# EAGLE design SOL_R2 (EAGLE 7.7.0)

## Sheet 1 of 2
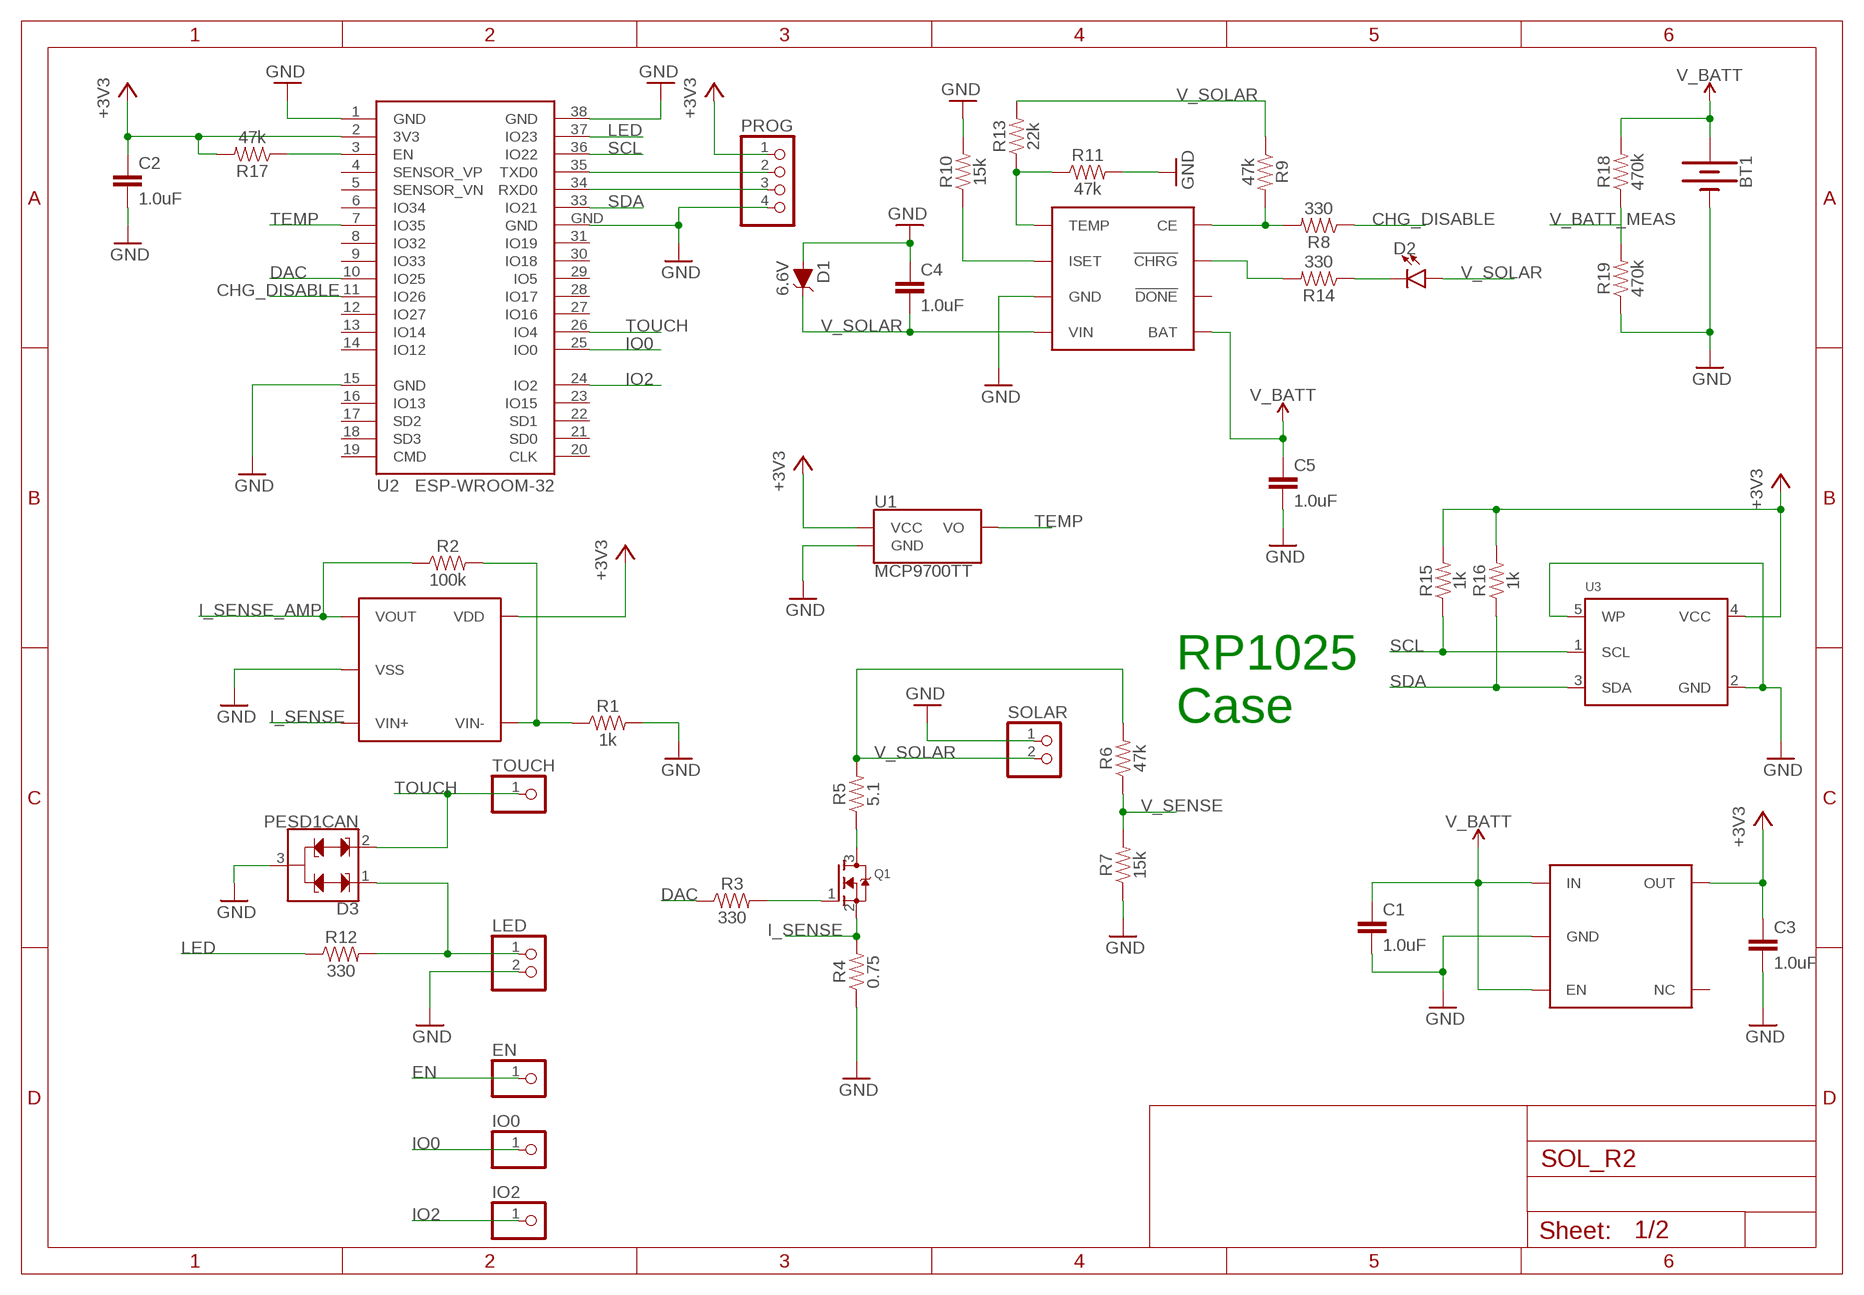
[diagram p0: schematic, sheet 1]

### Parts
BT1  BATTERY-AA  [BATTERY-AA]
C1  1.0uF  1.0UF-0805-25V-10%  [0805]
C2  1.0uF  1.0UF-0805-25V-10%  [0805]
C3  1.0uF  1.0UF-0805-25V-10%  [0805]
C4  1.0uF  1.0UF-0805-25V-10%  [0805]
C5  1.0uF  1.0UF-0805-25V-10%  [0805]
D1  6.6V  DIODE-ZENER-MMSZ5232BS  [SOD-323]
D2  LED0603  [LED-0603]
D3  PESD1CAN  [SOT23-3]
EN  PINHD-1X1  [1X01]
IO0  PINHD-1X1  [1X01]
IO2  PINHD-1X1  [1X01]
LED  PINHD-1X2  [1X02]
PROG  PINHD-1X4  [1X04]
Q1  MOSFET-NREFLOW  [SOT23-R]
R1  1k  2.2KOHM-0603-1/10W-1%  [0603]
R2  100k  2.2KOHM-0603-1/10W-1%  [0603]
R3  330  2.2KOHM-0603-1/10W-1%  [0603]
R4  0.75  0.3OHM-0805-1/8W-1%  [0805]
R5  5.1  33OHM-0603-1/10W-1%  [0603]
R6  47k  47KOHM-0603-1/10W-1%  [0603]
R7  15k  15KOHM-0603-1/10W-1%  [0603]
R8  330  2.2KOHM-0603-1/10W-1%  [0603]
R9  47k  47KOHM-0603-1/10W-1%  [0603]
R10  15k  15KOHM-0603-1/10W-1%  [0603]
R11  47k  47KOHM-0603-1/10W-1%  [0603]
R12  330  2.2KOHM-0603-1/10W-1%  [0603]
R13  22k  47KOHM-0603-1/10W-1%  [0603]
R14  330  2.2KOHM-0603-1/10W-1%  [0603]
R15  1k  2.2KOHM-0603-1/10W-1%  [0603]
R16  1k  2.2KOHM-0603-1/10W-1%  [0603]
R17  47k  47KOHM-0603-1/10W-1%  [0603]
R18  470k  2.2KOHM-0603-1/10W-1%  [0603]
R19  470k  2.2KOHM-0603-1/10W-1%  [0603]
SOLAR  PINHD-1X2  [1X02]
TOUCH  PINHD-1X1  [1X01]
U1  MCP9700TT  [SOT23-3]
U2  ESP-WROOM-32  [ESP-WROOM-32]
U3  EEPROM_I2C_MCP24AA32  [SOT23-5]
U5  MCP6001  [SOT23-5L]
U6  TLV755  [SOT23-DBV]
U7  DIO5158XM8  [MSOP8]

### Nets
+3V3: C2.1 C3.1 PROG.1 R15.2 R16.2 R17.2 U1.1(VCC) U2.2(3V3) U3.4(VCC) U5.5(VDD) U6.5(OUT) ; also sheet 2
CHG_DISABLE: R8.1 U2.11(IO26)
DAC: R3.1 U2.10(IO25)
EN: EN.1 R17.1 U2.3(EN)
GND: BT1.GND@1(-) C1.2 C2.2 C3.2 C4.1 C5.2 D1.A D3.3 LED.2 PROG.4 R1.2 R4.1 R7.1 R10.2 R11.2 R19.1 SOLAR.1 U1.3(GND) U2.1(GND) U2.15(GND) U2.38(GND) U2.GND U3.2(GND) U3.5(WP) U5.2(VSS) U6.2(GND) U7.3(GND) ; also sheet 2
I_SENSE: Q1.2(S) R4.2 U5.3(VIN+)
I_SENSE_AMP: R2.1 U5.1(VOUT) ; also sheet 2
IO0: IO0.1 U2.25(IO0)
IO2: IO2.1 U2.24(IO2)
LED: R12.1 U2.37(IO23)
N$2: R10.1 U7.2(ISET)
N$3: D3.1 LED.1 R12.2
N$4: R11.1 R13.1 U7.1(TEMP)
N$5: Q1.1(G) R3.2
N$6: R1.1 R2.2 U5.4(VIN-)
N$7: Q1.3(D) R5.1
N$8: R8.2 R9.2 U7.8(CE)
N$9: R14.2 U7.7(!CHRG!)
N$11: D2.C R14.1
RXD: PROG.3 U2.34(RXD0)
SCL: R15.1 U2.36(IO22) U3.1(SCL) ; also sheet 2
SDA: R16.1 U2.33(IO21) U3.3(SDA) ; also sheet 2
TEMP: U1.2(VO) U2.7(IO35)
TOUCH: D3.2 TOUCH.1 U2.26(IO4)
TXD: PROG.2 U2.35(TXD0)
V_BATT: BT1.PWR@1(+) C1.1 C5.1 R18.2 U6.1(IN) U6.3(EN) U7.5(BAT)
V_BATT_MEAS: R18.1 R19.2 ; also sheet 2
V_SENSE: R6.1 R7.2 ; also sheet 2
V_SOLAR: C4.2 D1.C D2.A R5.2 R6.2 R9.1 R13.2 SOLAR.2 U7.4(VIN)
Unconnected: U2.4(SENSOR_VP) U2.5(SENSOR_VN) U2.6(IO34) U2.8(IO32) U2.9(IO33) U2.12(IO27) U2.13(IO14) U2.14(IO12) U2.16(IO13) U2.17(SD2) U2.18(SD3) U2.19(CMD) U2.20(CLK) U2.21(SD0) U2.22(SD1) U2.23(IO15) U2.27(IO16) U2.28(IO17) U2.29(IO5) U2.30(IO18) U2.31(IO19) U6.4(NC) U7.6(!DONE!)

### Notes on the sheet
- RP1025
  Case

## Sheet 2 of 2
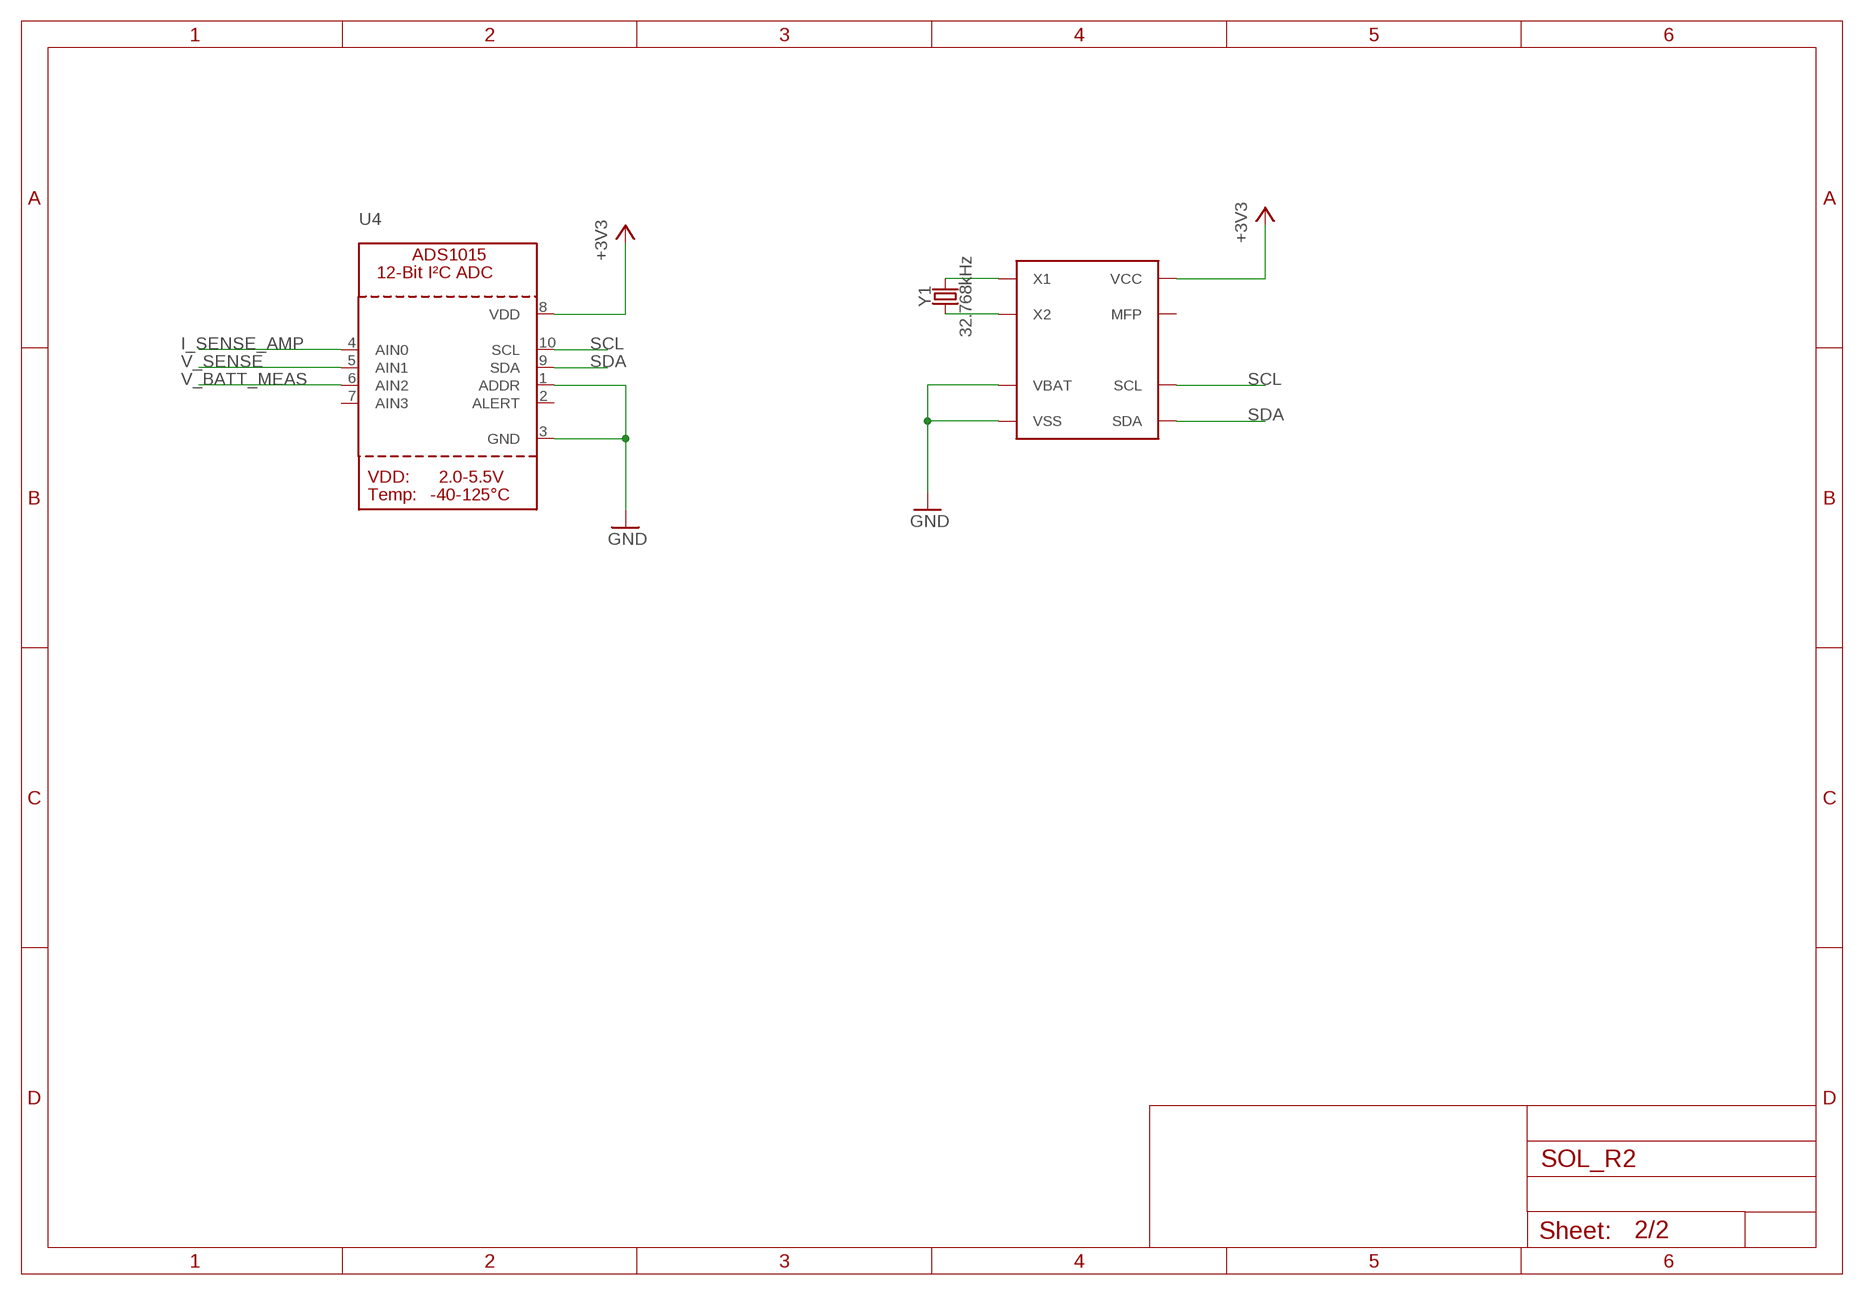
[diagram p1: schematic, sheet 2]

### Parts
U4  ADC_ADS1015  [MSOP10]
U8  MCP7940  [MSOP8]
Y1  32.768kHz  CRYSTAL-32.768KHZSMD-3.2X1.5  [CRYSTAL-SMD-3.2X1.5MM]

### Nets
+3V3: U4.8(VDD) U8.8(VCC) ; also sheet 1
GND: U4.1(ADDR) U4.3(GND) U8.3(VBAT) U8.4(VSS) ; also sheet 1
I_SENSE_AMP: U4.4(AIN0) ; also sheet 1
N$1: U8.1(X1) Y1.P$2
N$10: U8.2(X2) Y1.P$1
SCL: U4.10(SCL) U8.6(SCL) ; also sheet 1
SDA: U4.9(SDA) U8.5(SDA) ; also sheet 1
V_BATT_MEAS: U4.6(AIN2) ; also sheet 1
V_SENSE: U4.5(AIN1) ; also sheet 1
Unconnected: U4.2(ALERT) U4.7(AIN3) U8.7(MFP)

## Library data of the parts
BT1 = SparkFun-Batteries:BATTERY: Battery - Single Cell A variety of battery chemistries, sizes, and footprints. Device List: 20MM_PTH - Coin Cell Battery Holder - 20mm (PTH) <https://www.sparkfun.com/products/783> 12MM_SMD - Coin Cell Battery Holder - 12mm (SMD) <https://www.sparkfun.com/products/10592> 12MM_PTH - Coin Cell Battery Holder - 12mm (PTH) <https://www.sparkfun.com/products/7948> 20MM_SMD - 20mm Coin Cell Battery Holder (SMD) (2 legs) Used on the Big Time Watch Kit <https://www.sparkfun.com/products/11734> 20MM_SMD_4LEGS - Coin Cell Battery Holder - 20mm (SMD) <https://www.sparkfun.com/products/11892> 20MM_SMD_4LEGS_OVERPASTE - Coin Cell Battery Holder - 20mm (SMD) <https://www.sparkfun.com/products/11892> (Over-paste on the legs) 24.5MM_PTH - Coin Cell Battery Holder - 24.5mm (PTH) <https://www.sparkfun.com/products/8863> 9V - 9V Battery Holder - PC Mount Used on the SparkFun SparkPunk Sound Kit <https://www.sparkfun.com/products/11177> and SparkFun SparkPunk Sequencer Kit <https://www.sparkfun.com/products/12707> 18650 - Battery Holder - 18650 (PTH) <https://www.sparkfun.com/products/13113> AA - Battery Holder - 1xAA (PTH) <https://www.sparkfun.com/products/7949> AAA - Battery Holder - 1xAAA (PTH) <https://www.sparkfun.com/products/12718> AA_KIT - Battery Holder - 1xAA (PTH) <https://www.sparkfun.com/products/7949> Special kit package - pads only have exposed copper on one side of the board. AAA_KIT - Battery Holder - 1xAAA (PTH) <https://www.sparkfun.com/products/12718> Special kit package - pads only have exposed copper on one side of the board.; PROD_ID: BATT-08316; SF_SKU: PRT-07949
C1-C5 = SparkFun-Capacitors:1.0UF: 1µF ceramic capacitors A capacitor is a passive two-terminal electrical component used to store electrical energy temporarily in an electric field.; PROD_ID: CAP-08064
D1 = SparkFun-DiscreteSemi:DIODE-ZENER: Zener Diode A Zener diode allows current to flow from its anode to its cathode like a normal semiconductor diode, but it also permits current to flow in the reverse direction when its "Zener voltage" is reached. - WIkipedia; PROD_ID: DIO-12442; VALUE: 5.6V
D2 = SparkFun-LED:LED: LED (Generic) Standard schematic elements and footprints for 5mm, 3mm, 1206, and 0603 sized LEDs. Generic LEDs with no color specified.
D3 = SparkFun-DiscreteSemi:PESD1CAN: CAN bus ESD protection diode PESD1CAN is used to protect two CAN bus lines from ESD. Link to datasheet <http://www.nxp.com/documents/data_sheet/PESD1CAN-U.pdf> SparkFun Products: SparkFun CAN-BUS Shield <https://www.sparkfun.com/products/13262>; PROD_ID: DIO-12501
EN IO0 IO2 TOUCH = pinhead:PINHD-1X1: PIN HEADER
LED SOLAR = pinhead:PINHD-1X2: PIN HEADER
PROG = pinhead:PINHD-1X4: PIN HEADER
Q1 = microbuilder:MOSFET-N: N-Channel Mosfet LEGEND VDS: Voltage Drain-Source ID: Drain Current RDS(ON): Drain-Source On-State Resistance VGS(TH): Gate-Source Threshold Voltage CISS: Drain-Source Input Capacitance SOT-23 Name VDS ID RDS(ON) VGS(TH) CISS Order Number 2N7002E 60V 260mA 2.5 Ohm 2.5V @ 250uA 26.7pF @ 25V 2N7002ET1GOSTR-ND BSH103 30V 850mA 400 mOhm 400mV @ 1mA 83pF @ 24V BSH103,235-ND BSS138 60V 320mA 1.6 Ohm 1.5V @ 250uA 50pF @ 10V Mouser: 771-BSS138PW115 DMN2075U-7 20V 4.2A 38 mOhm 1V @ 250 uA 594.3pF @ 10V DMN2075U-7DICT-ND * BSS138 good choice for I2C level-shifting
R1-R3 R8 R12 R14-R16 R18 R19 = SparkFun-Resistors:2.2KOHM: 2.2kΩ resistor A resistor is a passive two-terminal electrical component that implements electrical resistance as a circuit element. Resistors act to reduce current flow, and, at the same time, act to lower voltage levels within circuits. - Wikipedia; PROD_ID: RES-08272; VALUE: 2.2k
R4 = SparkFun-Resistors:0.3OHM: 0.3Ω resistor A resistor is a passive two-terminal electrical component that implements electrical resistance as a circuit element. Resistors act to reduce current flow, and, at the same time, act to lower voltage levels within circuits. - Wikipedia; PROD_ID: RES-11622; VALUE: 0.3
R5 = SparkFun-Resistors:33OHM: 33Ω resistor A resistor is a passive two-terminal electrical component that implements electrical resistance as a circuit element. Resistors act to reduce current flow, and, at the same time, act to lower voltage levels within circuits. - Wikipedia; PROD_ID: RES-08270; VALUE: 33
R6 R9 R11 R17 = SparkFun-Resistors:47KOHM: 47kΩ resistor A resistor is a passive two-terminal electrical component that implements electrical resistance as a circuit element. Resistors act to reduce current flow, and, at the same time, act to lower voltage levels within circuits. - Wikipedia; PROD_ID: RES-07871
R7 R10 = SparkFun-Resistors:15KOHM: 15kΩ resistor A resistor is a passive two-terminal electrical component that implements electrical resistance as a circuit element. Resistors act to reduce current flow, and, at the same time, act to lower voltage levels within circuits. - Wikipedia; PROD_ID: RES-07854
R13 = SparkFun-Resistors:47KOHM: 47kΩ resistor A resistor is a passive two-terminal electrical component that implements electrical resistance as a circuit element. Resistors act to reduce current flow, and, at the same time, act to lower voltage levels within circuits. - Wikipedia; PROD_ID: RES-07871; VALUE: 47k
U1 = SparkFun-Sensors:MCP9700: Microchip MCP9700 Analog-Output Temperature Sensor The MCP9700 can accurately measure temperature from -40C to +150C. The output of the MCP9700 is calibrated to a slope of 10mV/°C and has a DC offset of 500mV. The offset allows reading negative temperatures without the need for a negative supply. Datasheet <http://ww1.microchip.com/downloads/en/DeviceDoc/20001942F.pdf> SparkFun Products LilyPad Temperature Sensor <https://www.sparkfun.com/products/8777> (DEV-08777) SparkFun Digital Sandbox <https://www.sparkfun.com/products/12651> (DEV-12651); PROD_ID: IC-08917
U2 = esp32:ESP-WROOM-32: Espressif Systems ESP-WROOM-32
U3 = microbuilder:EEPROM_I2C_MCP24AA32: Microchip 32K (4K x 8) 1.8V I2C EEPROM SOT23-5 [Digikey: 24AA32AFT-I/OTCT-ND]
U4 = microbuilder:ADC_ADS1015: ADS1015 - 12-bit 4-Channel I2C ADC with Internal PGA VDD: 2.0-5.5V Sampling Rate: 3.3ksps Gain Settings: 2/3, 1, 2, 4, 8, 16 I2C Address: ADDR low = 1001000x, ADDR high = 1001001x Internal Comparator The ADS1015 includes an internal comparator that can be set to output a high-level on ALERT when the conversion results exceeeds a pre-defined upper level, and will deassert itself when the level falls below a pre-defined lower threshold level. It can also be set to windowed mode where the ALERT pin will be asserted if the data exceeds the upper threshold or falls below the lower threshold.
U5 = microchip:MCP6001
U6 = texas:TLV755
U7 = DIOO:DIO5158XM8
U8 = microchip:MCP7940: RTC Real Time Clock
Y1 = SparkFun-Clocks:CRYSTAL-32.768KHZ: 32.768kHz Crystal Frequency: 32.768kHz Frequency Stability: ±20ppm Load Capacitance: 12.5pF (PTH-2X6 & SMD-3.2X1.5), 6pF (SMD-2X6) SparkFun Products: SparkFun BigTime Watch Kit <https://www.sparkfun.com/products/11734> SparkFun nRF52832 Breakout <https://www.sparkfun.com/products/13990> SparkFun Real Time Clock Module <https://www.sparkfun.com/products/12708>; PROD_ID: XTAL-13062

## Board
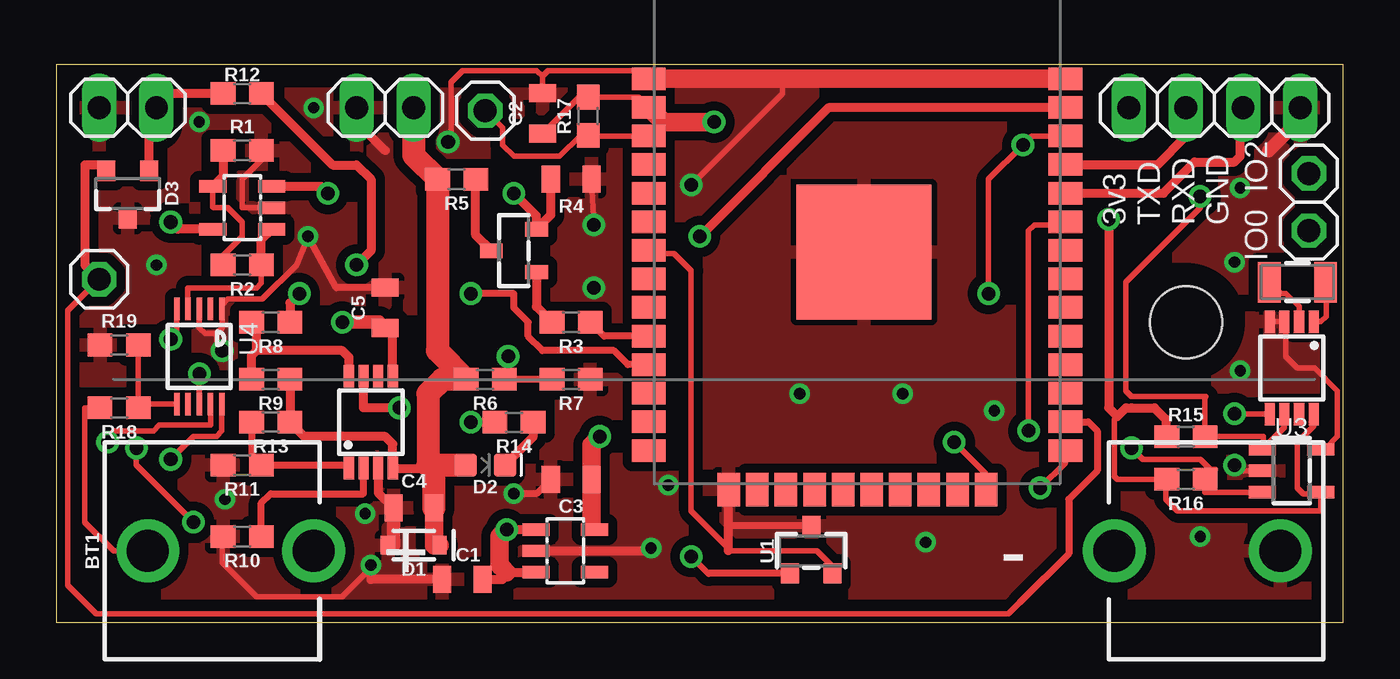
[diagram p2: board, top side]
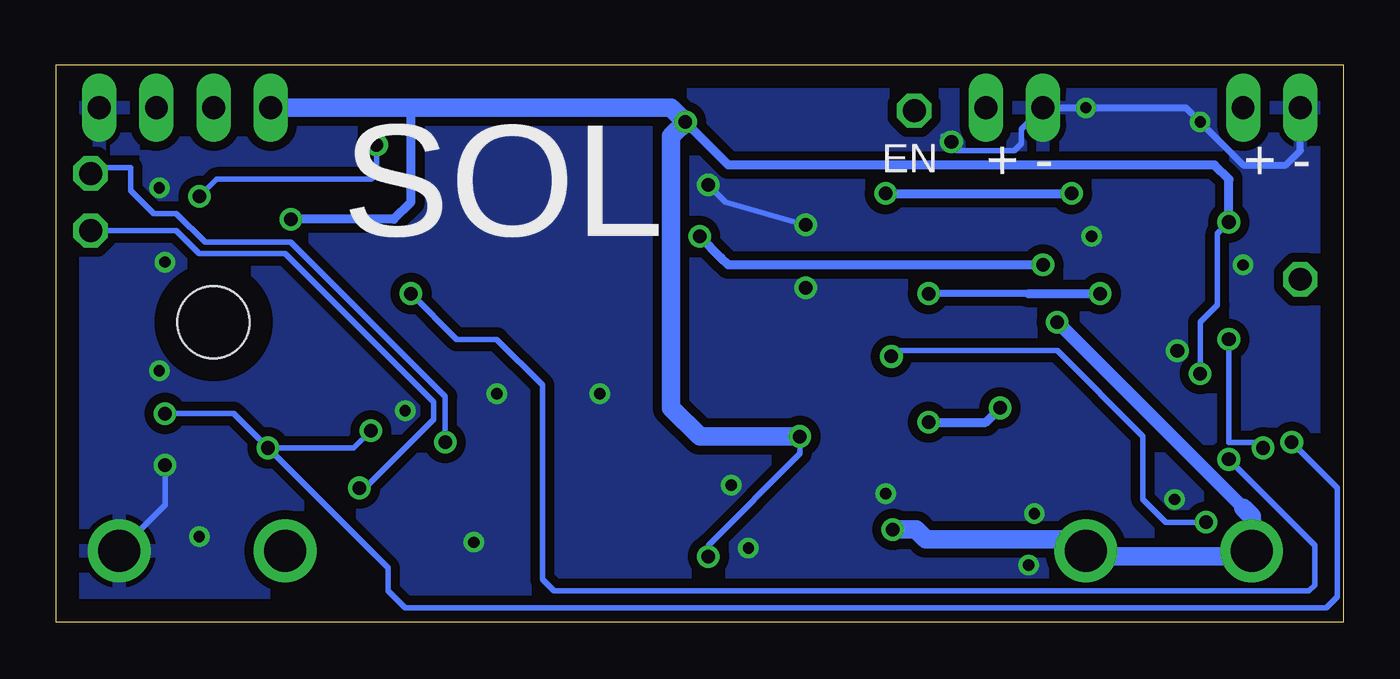
[diagram p3: board, bottom side, seen from below]

Size 57.15 x 24.77 mm. Coordinates in mm from the lower left corner, seen from the top.
Outline: 0,0 57.15,0 57.15,24.77 0,24.77 0,0
Copper layers (1*16): Top 0.035mm / dielectric 1.5mm / Bottom 0.035mm
Design rules "default": minimum track width 10mil, minimum drill 24mil, track to track 8mil, track to pad 8mil, pad to pad 8mil, via to via 8mil, smd to smd 8mil, copper to edge 40mil, drill to drill 8mil, minimum pad ring 10mil, minimum via ring 8mil, stop-mask expansion 4mil, vias tented up to drill 0mil, thermal gap 10mil
Holes 3.2 mm at 50.16,13.33

### Footprints (pad centres in the part's own frame; a part is rotated, then mirrored left to right if it is on the bottom)
BATTERY-AA = drill 1.854: GND@1 25.146,0; GND@2 17.78,0; PWR@1 -25.146,0; PWR@2 -17.78,0
0805 = smd 0.8 x 1.2: 1 -0.9,0; 2 0.9,0
SOD-323 = smd 0.63 x 0.83: A 1.15,0; C -1.15,0
LED-0603 = smd 1 x 1: A -0.877,0; C 0.877,0
SOT23-3 = smd 0.8 x 0.9: 1 -0.95,-1; 2 0.95,-1; 3 0,1.1
1X01 = drill 1.016 octagon: 1 0,0
1X02 = drill 1.016 long: 1 -1.27,0; 2 1.27,0
1X04 = drill 1.016 long: 1 -3.81,0; 2 -1.27,0; 3 1.27,0; 4 3.81,0
SOT23-R = smd 0.635 x 1.016: 1 -0.95,-1; 2 0.95,-1; 3 0,1
0603 = smd 1.1 x 1: 1 -0.85,0; 2 0.85,0
ESP-WROOM-32 = smd 1.5 x 1: 1 -9.25,7; 2 -9.25,5.73; 3 -9.25,4.46; 4 -9.25,3.19; 5 -9.25,1.92; 6 -9.25,0.65; 7 -9.25,-0.62; 8 -9.25,-1.89; 9 -9.25,-3.16; 10 -9.25,-4.43; 11 -9.25,-5.7; 12 -9.25,-6.97; 13 -9.25,-8.24; 14 -9.25,-9.51; 25 9.25,-9.51; 26 9.25,-8.24; 27 9.25,-6.97; 28 9.25,-5.7; 29 9.25,-4.43; 30 9.25,-3.16; 31 9.25,-1.89; 32 9.25,-0.62; 33 9.25,0.65; 34 9.25,1.92; 35 9.25,3.19; 36 9.25,4.46; 37 9.25,5.73; 38 9.25,7 | smd 1 x 1.5: 15 -5.7,-11.25; 16 -4.43,-11.25; 17 -3.16,-11.25; 18 -1.89,-11.25; 19 -0.62,-11.25; 20 0.65,-11.25; 21 1.92,-11.25; 22 3.19,-11.25; 23 4.46,-11.25; 24 5.73,-11.25 | smd 6 x 6: GND 0.3,-0.7
SOT23-5 = smd 0.55 x 1.2: 1 -0.95,-1.3; 2 0,-1.3; 3 0.95,-1.3; 4 0.95,1.3; 5 -0.95,1.3
MSOP10 = smd 0.25 x 1: 1 -1,-2.113; 2 -0.5,-2.113; 3 0,-2.113; 4 0.5,-2.113; 5 1,-2.113; 6 1,2.113; 7 0.5,2.113; 8 0,2.113; 9 -0.5,2.113; 10 -1,2.113
SOT23-5L = smd 0.55 x 1.2: 1 -0.95,-1.3; 2 0,-1.3; 3 0.95,-1.3; 4 0.95,1.3; 5 -0.95,1.3
SOT23-DBV = smd 0.55 x 1.2: 1 -0.95,-1.3; 2 0,-1.3; 3 0.95,-1.3; 4 0.95,1.3; 5 -0.95,1.3
MSOP8 = smd 0.45 x 1: 1 -0.975,-2.05; 2 -0.325,-2.05; 3 0.325,-2.05; 4 0.975,-2.05; 5 0.975,2.05; 6 0.325,2.05; 7 -0.325,2.05; 8 -0.975,2.05
CRYSTAL-SMD-3.2X1.5MM = smd 1 x 1.8: P$1 -1.25,0; P$2 1.25,0

### Placement (x,y rotation side)
BT1  29.21,3.17 0 top
C1  18.03,1.9 180 top
C2  21.59,22.61 90 top
C3  22.86,6.35 180 top
C4  15.88,5.08 0 top
C5  14.61,13.97 90 top
D1  15.88,3.43 180 top
D2  19.05,6.98 0 top
D3  3.17,19.05 180 top
EN  19.05,22.73 0 top
IO0  55.63,17.4 90 top
IO2  55.63,19.94 90 top
LED  3.17,22.86 180 top
PROG  51.44,22.86 0 top
Q1  20.32,16.51 90 top
R1  8.26,20.95 0 top
R2  8.26,15.87 180 top
R3  22.86,13.33 180 top
R4  22.86,19.69 180 top
R5  17.78,19.69 180 top
R6  19.05,10.79 180 top
R7  22.86,10.79 180 top
R8  9.53,13.33 180 top
R9  9.53,10.79 180 top
R10  8.26,3.81 180 top
R11  8.26,6.98 180 top
R12  8.26,23.49 180 top
R13  9.53,8.89 0 top
R14  20.32,8.89 180 top
R15  50.16,8.26 180 top
R16  50.16,6.35 180 top
R17  23.62,22.48 90 top
R18  2.79,9.53 180 top
R19  2.79,12.32 0 top
SOLAR  14.61,22.86 0 top
TOUCH  1.91,15.24 0 top
U1  33.53,3.17 0 top
U2  35.56,17.14 0 top
U3  54.86,6.73 270 top
U4  6.35,11.81 180 top
U5  8.26,18.41 90 top
U6  22.61,3.17 270 top
U7  13.97,8.89 0 top
U8  54.86,11.3 180 top
Y1  55.12,15.11 0 top

### Tracks (layer width: path | path; a pad name or v marks a point on that pad's centre or on a via)
+3V3  (via drill 0.6)
  Top 0.254: U2.2 25.86,23.33 R17.2 23.21,23.33 C2.1 | 47.12,9.14 46.99,9.02 46.99,6.48 47.12,6.35 R16.2 49.28,6.31 49.28,5.46 49.78,4.95 56.16,4.95 U3.4 56.1,5.71 55.37,5.71 55.12,5.97 55.12,8 55.84,8.72 U8.8 | 49.28,8.29 R15.2 | U4.8 v6.35,11.05 | 28.97,2.17 28.94,2.17 v28.19,2.92 | U6.5 23.91,4.28 23.76,4.42
  Top 0.305: U1.1 28.97,2.17
  Top 0.406: U5.5 5.39,17.46 v5.08,17.78 | 47.5,9.53 47.12,9.14 46.74,9.53 v46.74,17.91 | 47.5,9.53 48.77,9.53 49.28,9.02 49.28,8.29 | 47.5,9.53 47.75,9.53
  Top 0.813: v29.21,22.23 26.96,22.23 U2.2 | 23.76,4.42 C3.1 23.76,7.88 v24.13,8.26
  Bottom 0.254: v6.35,11.05 6.35,13.33 5.59,14.1 5.59,17.27 v5.08,17.78 | v28.19,2.92 28.19,3.43 24.13,7.49 v24.13,8.26
  Bottom 0.305: 41.4,22.61 41.66,22.86
  Bottom 0.406: v5.08,17.78 5.08,19.69 5.71,20.32 27.3,20.32 v29.21,22.23 | 41.4,22.61 41.4,18.67 42.16,17.91 v46.74,17.91
  Bottom 0.813: PROG.1 41.66,22.86 29.84,22.86 v29.21,22.23 29.84,21.59 29.84,9.53 28.57,8.26 v24.13,8.26
CHG_DISABLE  (via drill 0.6)
  Top 0.305: U2.11 25.39,11.44 24.77,12.06 21.59,12.06 20.95,12.7 20.95,13.33 20.32,13.97 20.32,14.6 v18.41,14.6
  Top 0.406: v10.79,14.6 10.38,14.19 R8.1
  Bottom 0.305: 13.97,14.6 v18.41,14.6
  Bottom 0.406: 13.97,14.6 v10.79,14.6
DAC
  Top 0.305: U2.10 24.33,12.71 R3.1
EN
  Top 0.254: U2.3 23.65,21.6 R17.1 23.28,21.63 22.35,20.7 20.32,20.7 19.81,21.21 19.81,21.97 EN.1
GND  (via drill 0.5, 0.6)
  Top 0.254: U5.2 8.26,18.41 8.26,19.69 9.11,20.53 R1.2 | 21.59,24.26 21.84,24.51 25.94,24.51 U2.1 | C2.2 21.59,24.26 | 21.59,24.26 21.34,24.51 18.03,24.51 17.53,24 17.53,21.46 v17.4,21.34 | R4.1 23.76,19.55 v23.88,17.65 | v28.19,19.43 32.26,23.49 32.26,24.14 | v11.18,17.14 10.67,15.87 9.14,14.35 7.62,14.35 7.35,14.08 U4.1 7.37,13.91 7.37,13.08 7.11,12.83 | U4.3 6.35,13.08 6.6,12.83 7.11,12.83 | 7.11,12.83 7.11,12.32 v7.37,12.06 | v13.97,2.54 13.97,2.41 12.7,1.14 8.89,1.14 7.37,2.67 7.37,3.77 R10.2 | U3.5 56.32,7.68 56.9,8.26 56.9,10.29 55.88,11.3 55.12,11.3 54.61,11.81 54.61,13.28 U8.3 U8.4 | U3.2 52.58,6.73 v52.32,6.98
  Top 0.305: C3.2 21.32,5.71 v20.32,5.71 | C5.2 12.44,14.87 v11.18,17.14 | U1.3 29.93,4.27 29.84,4.19
  Top 0.406: U7.3 14.29,5.76 C4.1 | 29.84,3.17 29.84,4.19 29.84,5.88 U2.15 | SOLAR.1 13.34,22.23 14.61,20.95 | U6.2 26.42,3.17 v26.42,3.3 | C1.2 13.97,1.9 v13.97,2.54
  Top 0.61: C4.1 14.97,3.42 D1.A | PROG.4 55.24,22.35 53.85,20.95
  Top 0.813: U2.38 32.26,24.14 U2.1
  Bottom 0.254: v17.4,21.34 17.78,21.59 17.14,20.95 14.61,20.95 14.29,21.27 14.29,21.91 SOLAR.1 | v23.88,17.65 27.43,18.67 v28.19,19.43 | v7.37,12.06 7.62,12.32 | v52.32,6.98 52.32,5.21 BT1.GND@1
  Bottom 0.305: SOLAR.1 6.99,22.86 4.45,20.32 2.54,20.32 1.91,20.95 LED.2
  other vias: 52.58,19.3 37.59,10.16 7.49,5.46 11.43,22.86 6.35,22.23 4.45,15.87 33.02,10.16 50.8,3.81 38.61,3.56 52.58,11.18 27.18,6.1 23.88,14.86 13.72,4.83 41.66,9.4 52.32,16
  pour Top (isolate 0.406): -2.54,-8.26 58.8,-8.26 58.8,26.67 36.32,26.67 36.32,27.05 -2.54,27.05
  pour Bottom (isolate 0.406): -1.27,-8.51 59.56,-8.51 58.93,26.67 36.32,26.67 36.32,27.05 -1.27,27.05
I_SENSE  (via drill 0.6)
  Top 0.406: R4.2 21.96,18.1 Q1.2 21.32,18.05 v20.32,19.05 | v12.06,19.05 11.75,19.37 U5.3
  Bottom 0.406: v20.32,19.05 v12.06,19.05
I_SENSE_AMP
  Top 0.254: R2.1 9.11,15.07 8.89,14.86 5.84,14.86 U4.4
  Top 0.406: R2.1 9.11,17.02 U5.1
IO0  (via drill 0.6)
  Top 0.254: U2.25 44.81,7.09 v43.69,5.97
  Bottom 0.254: v43.69,5.97 43.43,5.97 40.39,9.02 40.39,9.78 46.99,16.38 50.8,16.38 51.82,17.4 IO0.1
IO2  (via drill 0.6)
  Top 0.254: U2.24 41.29,6.59 v39.88,8
  Bottom 0.254: v39.88,8 39.88,10.03 46.74,16.89 50.55,16.89 51.82,18.16 52.83,18.16 53.85,19.18 53.85,20.19 55.37,20.19 IO2.1
LED  (via drill 0.6)
  Top 0.406: U2.37 44.8,22.86 34.29,22.86 v28.57,17.14 | R12.1 12.28,20.32 13.34,20.32 13.97,19.69 13.97,16.51 v13.34,15.87
  Bottom 0.406: v28.57,17.14 27.62,16.19 27.3,15.87 v13.34,15.87
N$1
  Top 0.254: U8.1 56.15,13.35 56.39,13.59 56.39,15.09 Y1.P$2
N$2
  Top 0.305: R10.1 9.11,5.29 9.53,5.71 13.64,5.71 U7.2
N$3
  Top 0.406: R12.2 5.08,23.49 LED.1 4.12,22.54 D3.1
N$4
  Top 0.305: R13.1 8.68,7.41 R11.1 12.85,6.98 U7.1
N$5
  Top 0.406: Q1.1 21.32,14.03 R3.2
N$6
  Top 0.254: R2.2 7.41,16.3 8.26,17.14 8.26,17.78 7.62,18.41 6.99,18.41 6.96,18.45 U5.4
  Top 0.406: R1.1 7.41,19.81 U5.4
N$7
  Top 0.406: Q1.3 18.63,17.2 R5.1
N$8
  Top 0.406: U7.8 12.99,11.77 12.7,12.06 8.89,12.06 | 8.89,12.06 8.89,13.12 R8.2 | R9.2 8.68,11.85 8.89,12.06
N$9  (via drill 0.6)
  Top 0.406: R14.2 v18.41,8.89 | v15.24,9.53 13.64,9.53 U7.7
  Bottom 0.406: v18.41,8.89 15.88,8.89 v15.24,9.53
N$10
  Top 0.254: U8.2 55.19,14.03 54.61,14.6 54.38,14.6 Y1.P$1
N$11
  Top 0.406: R14.1 21.17,8.23 D2.C
RXD
  Top 0.406: U2.34 49.16,19.06 50.55,20.45 52.32,20.45 52.58,20.7 52.58,22.73 PROG.3
SCL  (via drill 0.6)
  Top 0.254: 51.02,8.47 R15.1 | U2.36 43.32,21.6 v42.93,21.21 41.4,19.69 v41.4,14.6 | 50.8,8.47 R15.1 | v50.8,18.92 50.8,18.41 47.5,15.11 47.5,10.29 47.75,10.03 51.05,10.03 51.02,9.99 R15.1 | U4.10 7.35,8.49 7.11,8.26 6.1,8.26 v5.08,7.24 | R15.1 53.59,8.26 53.59,7.68 U3.1 54.54,8.66 U8.6
  Bottom 0.254: v42.93,21.21 42.93,19.94 43.18,19.69 50.04,19.69 v50.8,18.92 | v5.08,7.24 1.27,3.43 1.27,1.65 1.52,1.4 35.05,1.4 35.56,1.9 35.56,10.54 37.59,12.57 39.37,12.57 v41.4,14.6
SDA  (via drill 0.6)
  Top 0.254: v47.75,7.75 48.26,7.24 50.8,7.24 51.24,6.8 51.46,6.8 R16.1 51.02,5.78 U3.3 | v43.18,8.51 43.18,17.4 43.43,17.65 44.67,17.65 U2.33 | U4.9 6.86,8.76 4.57,8.76 4.32,8.51 2.54,8.51 2.29,8.26 v2.29,8 | U8.5 52.34,9.25 v52.32,9.27
  Bottom 0.254: v47.75,7.75 43.94,7.75 v43.18,8.51 | v47.75,7.75 42.42,2.41 42.42,1.4 41.66,0.63 0.76,0.63 0.25,1.14 0.25,5.97 v2.29,8 | v52.32,9.27 49.28,9.27 v47.75,7.75
TEMP
  Top 0.254: U1.2 34.48,2.48 33.78,3.17 29.97,3.17 28.19,4.95 28.19,15.62 27.43,16.38 26.45,16.38 U2.7
TOUCH
  Top 0.254: TOUCH.1 0.51,13.84 0.51,1.65 1.78,0.38 42.29,0.38 42.8,0.89
  Top 0.305: 42.8,0.89 44.96,3.05 44.96,5.46 46.23,6.73 46.23,8.51 45.83,8.9 U2.26
  Top 0.406: D3.2 1.96,20.32 1.27,20.32 1.27,15.87 TOUCH.1
TXD
  Top 0.406: PROG.2 50.16,21.59 48.9,20.32 44.83,20.32 U2.35
V_BATT  (via drill 0.6)
  Top 0.254: BT1.PWR@1 2.54,3.17 1.27,4.44 1.27,9.53 R18.2
  Top 0.406: U7.5 14.95,12.73 C5.1 | 20,2.22 U6.3 | v20,4.12 U6.1 | C1.1 19.81,1.9 19.81,2.41
  Top 0.61: v12.7,13.33 14.34,13.33 C5.1
  Top 0.813: v20,4.12 19.68,3.81 19.68,2.54 19.81,2.41 20,2.22
  Bottom 0.61: 4.45,5.08 v12.7,13.33
  Bottom 0.813: 4.45,5.08 4.06,4.7 BT1.PWR@1 4.32,2.92 11.43,2.92 12.19,3.68 18.54,3.68 18.98,4.12 v20,4.12
V_BATT_MEAS
  Top 0.254: R19.2 R18.1 3.82,9.7 U4.6
V_SENSE  (via drill 0.6)
  Top 0.254: U4.5 5.35,12.84 v5.08,12.57 | v20.07,11.81 20.07,10.96 R6.1 | v3.56,7.75 3.56,6.98 v6.1,4.44
  Top 0.305: R7.2 R6.1
  Bottom 0.254: v5.08,12.57 5.08,8 3.81,8 v3.56,7.75 | v6.1,4.44 7.87,4.44 8.89,5.46 8.89,8.26 12.7,12.06 19.81,12.06 v20.07,11.81
V_SOLAR
  Top 0.406: 16.51,6.98 16.36,6.84 U7.4 14.95,7.92 14.61,8.26 11.01,8.26 R13.2 R9.1
  Top 0.813: C4.2 16.77,3.42 D1.C
  Top 1.016: SOLAR.2 15.88,20.74 R5.2 16.93,12.06 R6.2 17.14,10.79 16.51,10.16 16.51,6.98 | 16.51,6.98 D2.A | C4.2 16.77,6.72 16.51,6.98

### Text on the board
tNames: 3v3 / TXD / RXD / GND
bNames: + - | + - | SOL